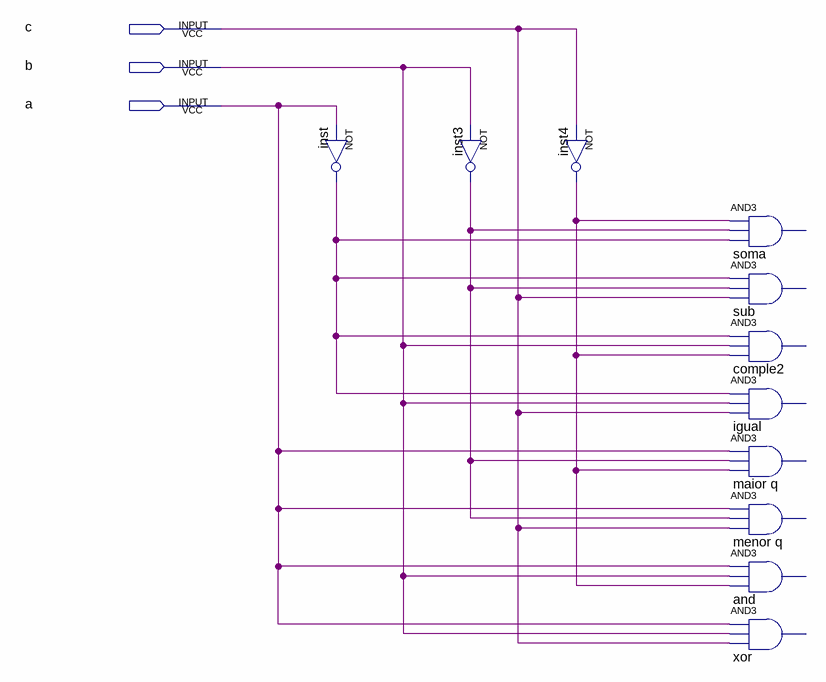
[diagram p0: schematic sheet]
// Quartus schematic escolha.bdf as structural Verilog: 11 symbols, 3 pins
module escolha (
  input  c,
  input  b,
  input  a
);

  wire inst3_out, inst4_out, inst_out;

  not inst (inst_out, a);
  not inst3 (inst3_out, b);
  not inst4 (inst4_out, c);
  // AND3 soma has open pins: IN1=inst4_out, IN2=inst3_out, IN3=inst_out, OUT=open
  // AND3 sub has open pins: IN1=inst_out, IN2=inst3_out, IN3=c, OUT=open
  // AND3 comple2 has open pins: IN1=inst_out, IN2=b, IN3=inst4_out, OUT=open
  // AND3 igual has open pins: IN1=inst_out, IN2=b, IN3=c, OUT=open
  // AND3 maior q has open pins: IN1=a, IN2=inst3_out, IN3=inst4_out, OUT=open
  // AND3 menor q has open pins: IN1=a, IN2=inst3_out, IN3=c, OUT=open
  // AND3 and has open pins: IN1=a, IN2=b, IN3=inst4_out, OUT=open
  // AND3 xor has open pins: IN1=a, IN2=b, IN3=c, OUT=open
endmodule
